# Altium schematic sheet Power_supply.SchDoc: SIM868 Development Board
size A4; SheetNumber: 12; SheetTotal: 14
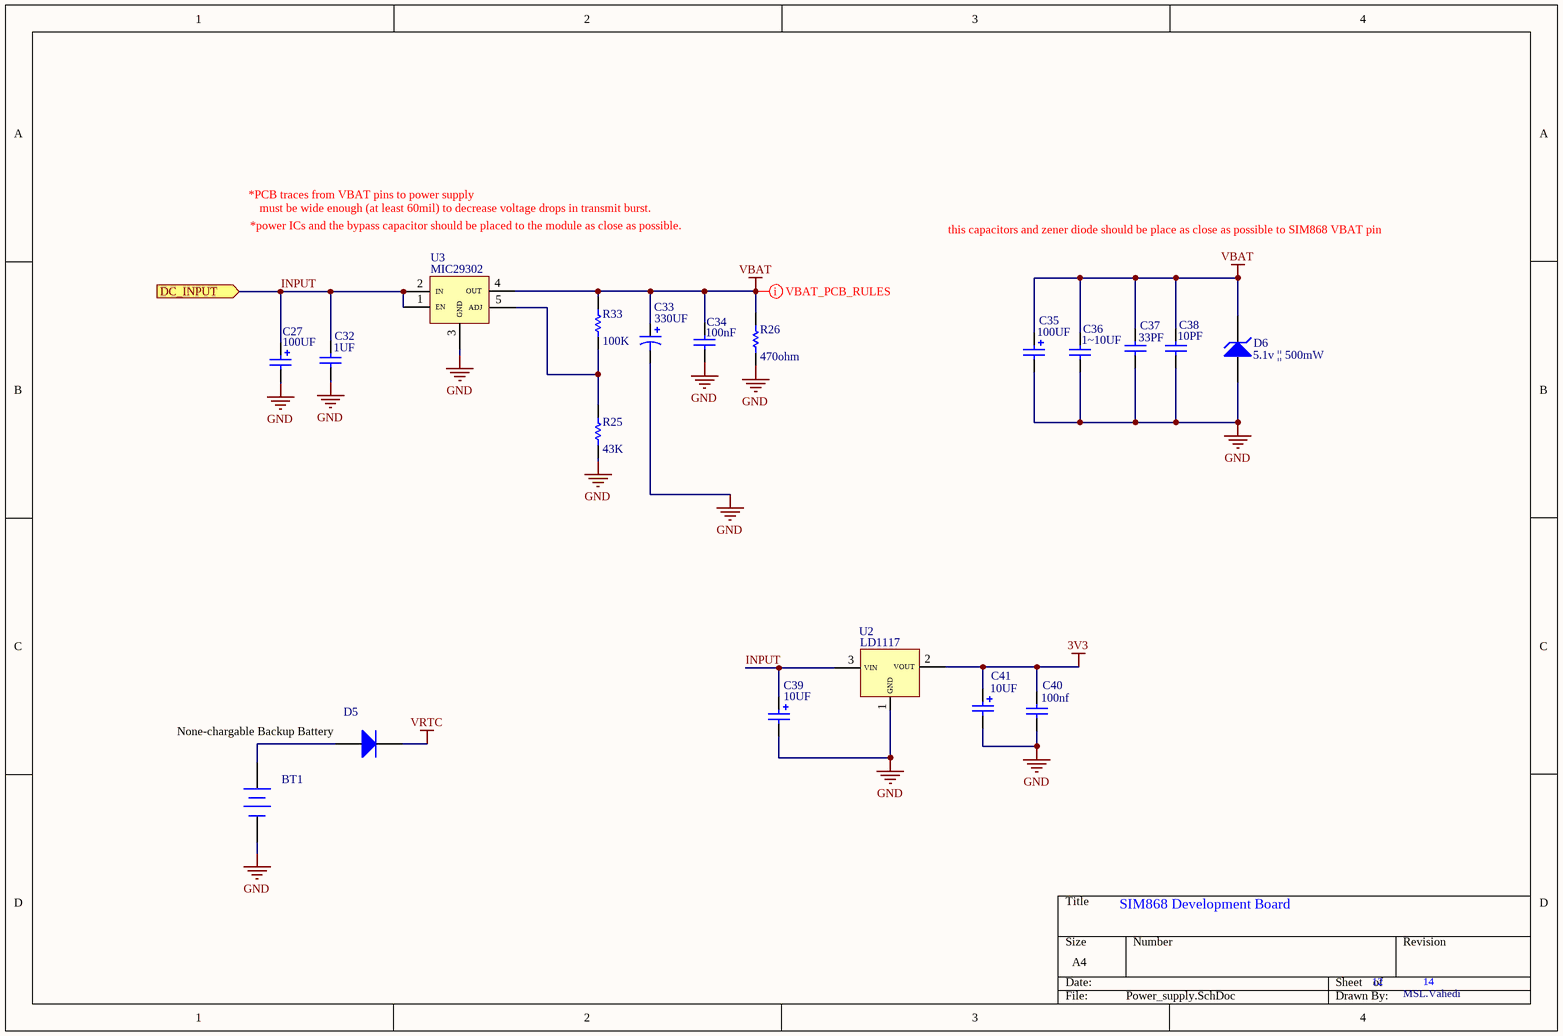
[diagram p0: Power_supply.SchDoc]

## Parts
BT1  None-chargable Backup Battery  [HDR1X2]
C27  value 100UF  [KEMET_A]
C32  value 1UF  [CAP0805]
C33  value 330UF  [KEMET_A]
C34  value 100nF  [CAP0805]
C35  value 100UF  [CAP0805]
C36  value 1~10UF  [CAP0805]
C37  value 33PF  [CAP0805]
C38  value 10PF  [CAP0805]
C39  value 10UF  [KEMET_A]
C40  value 100nf  [CAP0805]
C41  value 10UF  [KEMET_A]
D5  (no value)  [SOD-123]
D6  5.1v || 500mW  [SOD-123]
R25  value 43K  [RES0805]
R26  value 470ohm  [RES0805]
R33  value 100K  [RES0805]
U2  LD1117  [*DPAK228P972X240-3N]
U3  MIC29302  [MIC29302]

## Ports
DC_INPUT (in)

## Nets
3V3: C40.2 C41.1 U2.2(VOUT)
GND: BT1.2(-) C27.2 C32.1 C33.2 C34.1 C35.2 C36.2 C37.2 C38.2 C39.2 C40.1 C41.2 D6.1(A) R25.1 R26.1 U2.1(GND) U3.3(GND)
VBAT: C33.1 C34.2 C35.1 C36.1 C37.1 C38.1 D6.2(K) R26.2 R33.2 U3.4(OUT)
VRTC: D5.2(K)
INPUT: C27.1 C32.2 C39.1 U2.3(VIN) U3.1(EN) U3.2(IN) ; port DC_INPUT
NetBT1_1: BT1.1(+) D5.1(A)
NetR25_2: R25.2 R33.1 U3.5(ADJ)

## Layout directives
rule Width Constraint [Pref Width = 1.524mm    Min Width = 1.524mm    Max Width = 2mm]: VBAT

## Notes on the sheet
- *PCB traces from VBAT pins to power supply
- *power ICs and the bypass capacitor should be placed to the module as close as possible.
- must be wide enough (at least 60mil) to decrease voltage drops in transmit burst.
- this capacitors and zener diode should be place as close as possible to SIM868 VBAT pin
- MSL.Vahedi

## Library data of the parts
BT1 = Battery: Multicell Battery; Published: 24-Mar-1999; LatestRevisionDate: 17-Jul-2002; LatestRevisionNote: Re-released for DXP Platform.; PackageReference: BAT-2; Publisher: Altium Limited; PackageDescription: Battery; 2 Leads
C27 C35 C39 C41 = Cap Pol2: Polarized Capacitor (Axial); Published: 8-Jun-2000; LatestRevisionDate: 17-Jul-2002; LatestRevisionNote: Re-released for DXP Platform.; PackageReference: POLAR0.8; Publisher: Altium Limited; PackageDescription: Polarized Capacitor; 2 Leads
C32 C34 C36-C38 C40 = Cap: Capacitor; Published: 8-Jun-2000; LatestRevisionDate: 17-Jul-2002; LatestRevisionNote: Re-released for DXP Platform.; PackageReference: RAD-0.3; Publisher: Altium Limited; PackageDescription: Radial Cap, Thru-Hole; 2 Leads; 0.3 in Pin Spacing
C33 = Cap Pol1: Polarized Capacitor (Radial); Published: 8-Jun-2000; LatestRevisionDate: 17-Jul-2002; LatestRevisionNote: Re-released for DXP Platform.; PackageReference: RB7.6-15; Publisher: Altium Limited; PackageDescription: Polarized Capacitor (Radial); 2 Leads
D5 = Diode 1N4007: 1 Amp General Purpose Rectifier; Published: 8-Jun-2000; LatestRevisionDate: 17-Jul-2002; LatestRevisionNote: Re-released for DXP Platform.; DatasheetVersion: 1998; PackageVersion: Aug-1999; PackageReference: DO-41; Publisher: Altium Limited; PackageDescription: Diode, Axial; Body 5.2 x 2.7 mm (LxDia. max), Lead Dia. 0.86 mm (max); Code_JEDEC: DO-204-AL; ComponentLink1Description: Manufacturer Link; ComponentLink1URL: http://www.fairchildsemi.com/; ComponentLink2Description: Datasheet; ComponentLink2URL: http://www.fairchildsemi.com/ds/1N%2F1N4001.pdf
D6 = D Zener: MMSZ5231BT1G || PZ3DV2H || MMSZ4689-V || CDZ55V1SM; Published: 8-Jun-2000; LatestRevisionDate: 17-Jul-2002; LatestRevisionNote: Re-released for DXP Platform.; PackageReference: DIODE-0.7; Publisher: Altium Limited; PackageDescription: Diode, Thru-Hole; 2 Leads; 0.7 in Pin Spacing
R25 R26 R33 = Res1: Resistor; Published: 8-Jun-2000; LatestRevisionDate: 17-Jul-2002; LatestRevisionNote: Re-released for DXP Platform.; PackageReference: AXIAL-0.3; Publisher: Altium Limited; PackageDescription: Axial Device, Thru-Hole; 2 Leads; 0.3 in Pin Spacing
U3 = MIC29302: 3A Fast-Response LDO Regulator